# EAGLE design Cubesat (EAGLE 7.7.0)
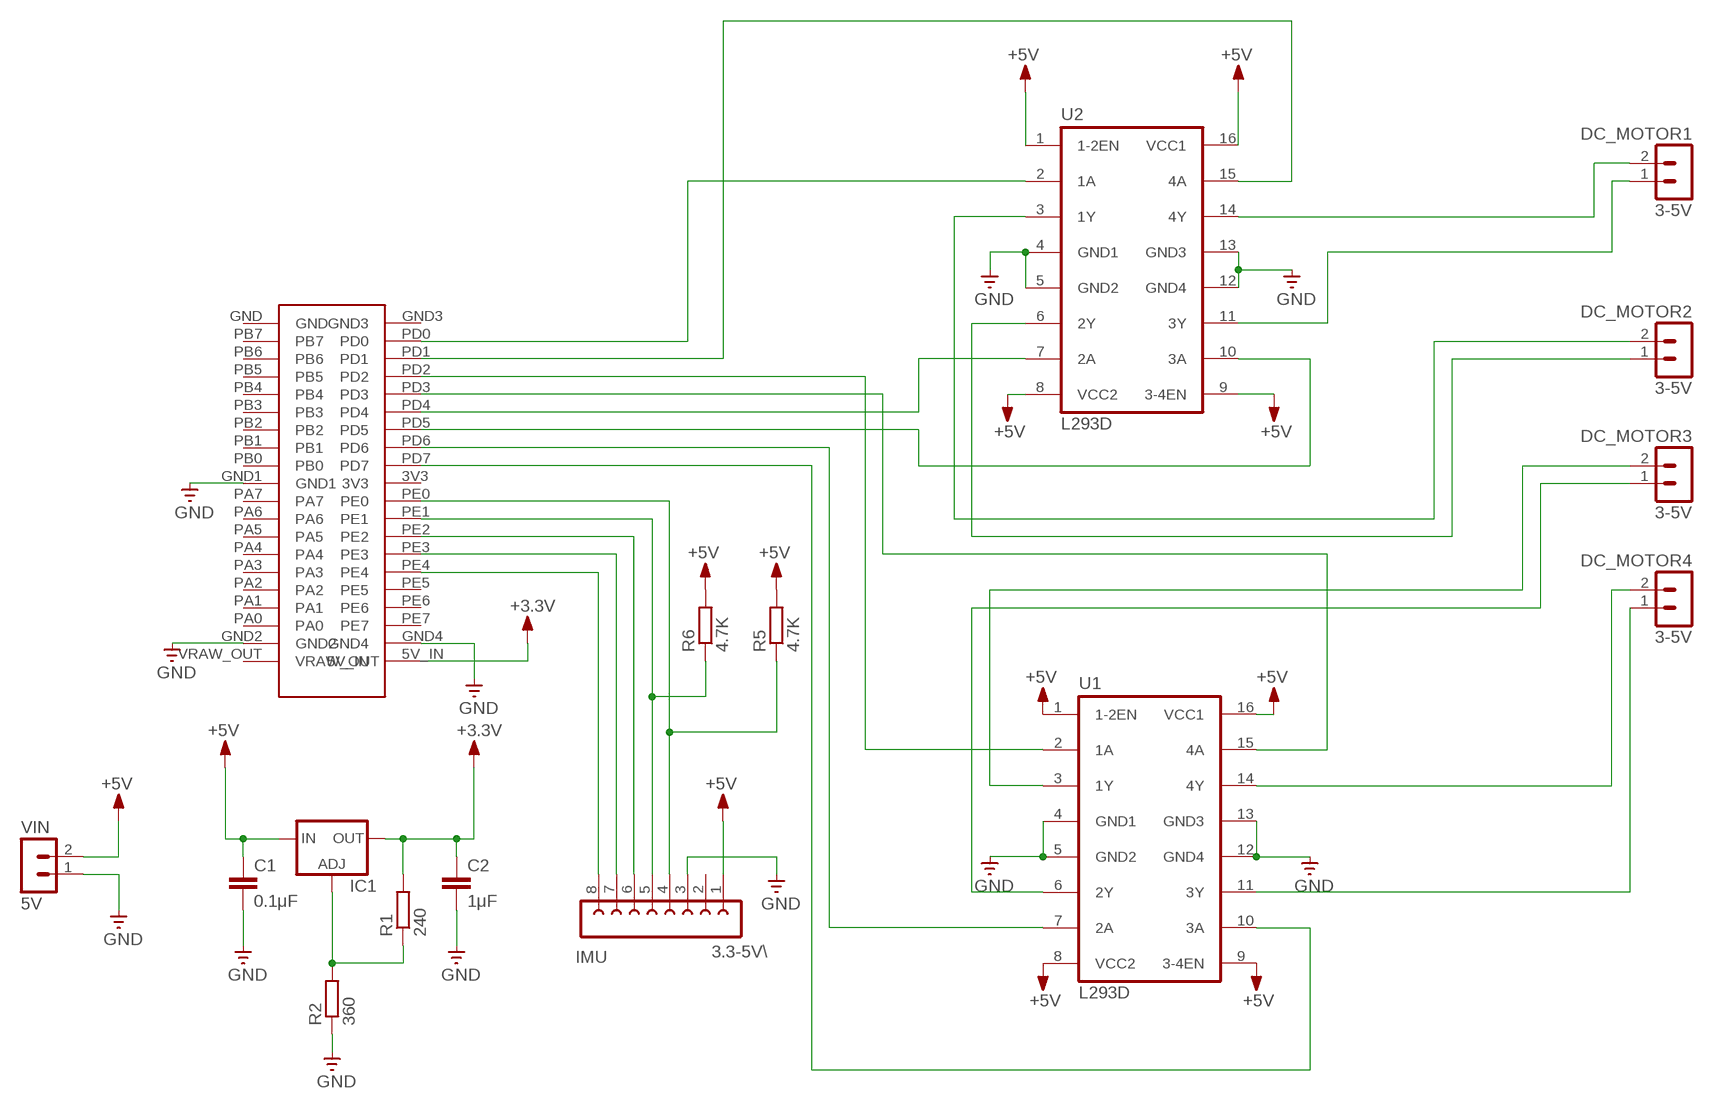
[diagram p0: schematic, sheet 1]

## Parts
C1  0.1μF  C-EUC1210  [C1210]
C2  1μF  C-EUC1210  [C1210]
DC_MOTOR1  3-5V  MA02-1Y  [MA02-1Y]
DC_MOTOR2  3-5V  MA02-1Y  [MA02-1Y]
DC_MOTOR3  3-5V  MA02-1Y  [MA02-1Y]
DC_MOTOR4  3-5V  MA02-1Y  [MA02-1Y]
IC1  LM317TS  [317TS]
IMU  3.3-5V\  FE08-1  [FE08-1]
R1  240  R-EU_M2012  [M2012]
R2  360  R-EU_M2012  [M2012]
R5  4.7K  R-EU_M2012  [M2012]
R6  4.7K  R-EU_M2012  [M2012]
U1  L293D  [DIL16]
U2  L293D  [DIL16]
VIN  5V  MA02-1Y  [MA02-1Y]
XMEGA256A3U  ATXMEGA256A3U  [ATXMEGA256A3U]

## Nets
+5V: C1.1 C2.1 IC1.2(OUT) IC1.3(IN) IMU.1 R1.2 R5.2 R6.2 U1.1(1-2EN) U1.8(VCC2) U1.9(3-4EN) U1.16(VCC1) U2.1(1-2EN) U2.8(VCC2) U2.9(3-4EN) U2.16(VCC1) VIN.2 XMEGA256A3U.5V_IN ; supply symbol labelled +3.3V
GND: C1.2 C2.2 IMU.3 R2.1 U1.4(GND1) U1.5(GND2) U1.12(GND4) U1.13(GND3) U2.4(GND1) U2.5(GND2) U2.12(GND4) U2.13(GND3) VIN.1 XMEGA256A3U.GND1 XMEGA256A3U.GND2 XMEGA256A3U.GND4
N$1: DC_MOTOR1.2 U2.14(4Y)
N$2: DC_MOTOR1.1 U2.11(3Y)
N$3: U2.2(1A) XMEGA256A3U.PD0
N$4: U1.2(1A) XMEGA256A3U.PD2
N$5: IMU.4 R5.1 XMEGA256A3U.PE0
N$6: IMU.5 R6.1 XMEGA256A3U.PE1
N$7: DC_MOTOR2.2 U2.3(1Y)
N$8: DC_MOTOR2.1 U2.6(2Y)
N$9: IMU.6 XMEGA256A3U.PE2
N$10: DC_MOTOR3.1 U1.6(2Y)
N$11: U1.15(4A) XMEGA256A3U.PD3
N$12: U2.7(2A) XMEGA256A3U.PD4
N$13: IMU.7 XMEGA256A3U.PE3
N$14: DC_MOTOR4.2 U1.14(4Y)
N$15: DC_MOTOR3.2 U1.3(1Y)
N$16: DC_MOTOR4.1 U1.11(3Y)
N$17: U1.10(3A) XMEGA256A3U.PD7
N$18: IMU.8 XMEGA256A3U.PE4
N$19: U2.15(4A) XMEGA256A3U.PD1
N$20: U1.7(2A) XMEGA256A3U.PD6
N$21: U2.10(3A) XMEGA256A3U.PD5
N$23: IC1.1(ADJ) R1.1 R2.2
Unconnected: IMU.2 XMEGA256A3U.3V3 XMEGA256A3U.GND XMEGA256A3U.GND3 XMEGA256A3U.PA0 XMEGA256A3U.PA1 XMEGA256A3U.PA2 XMEGA256A3U.PA3 XMEGA256A3U.PA4 XMEGA256A3U.PA5 XMEGA256A3U.PA6 XMEGA256A3U.PA7 XMEGA256A3U.PB0 XMEGA256A3U.PB1 XMEGA256A3U.PB2 XMEGA256A3U.PB3 XMEGA256A3U.PB4 XMEGA256A3U.PB5 XMEGA256A3U.PB6 XMEGA256A3U.PB7 XMEGA256A3U.PE5 XMEGA256A3U.PE6 XMEGA256A3U.PE7 XMEGA256A3U.VRAW_OUT

## Library data of the parts
C1 C2 = rcl:C-EU: CAPACITOR, European symbol
DC_MOTOR1-DC_MOTOR4 VIN = con-lstb:MA02-1: PIN HEADER
IC1 = v-reg:LM317TS: VOLTAGE REGULATOR
IMU = con-lsta:FE08-1: FEMALE HEADER
R1 R2 R5 R6 = rcl:R-EU_: RESISTOR, European symbol
U1 U2 = st-microelectronics:L293D: PUSH-PULL 4 CHANNEL DRIVER
XMEGA256A3U = atxmega256a3u:ATXMEGA256A3U

## Board
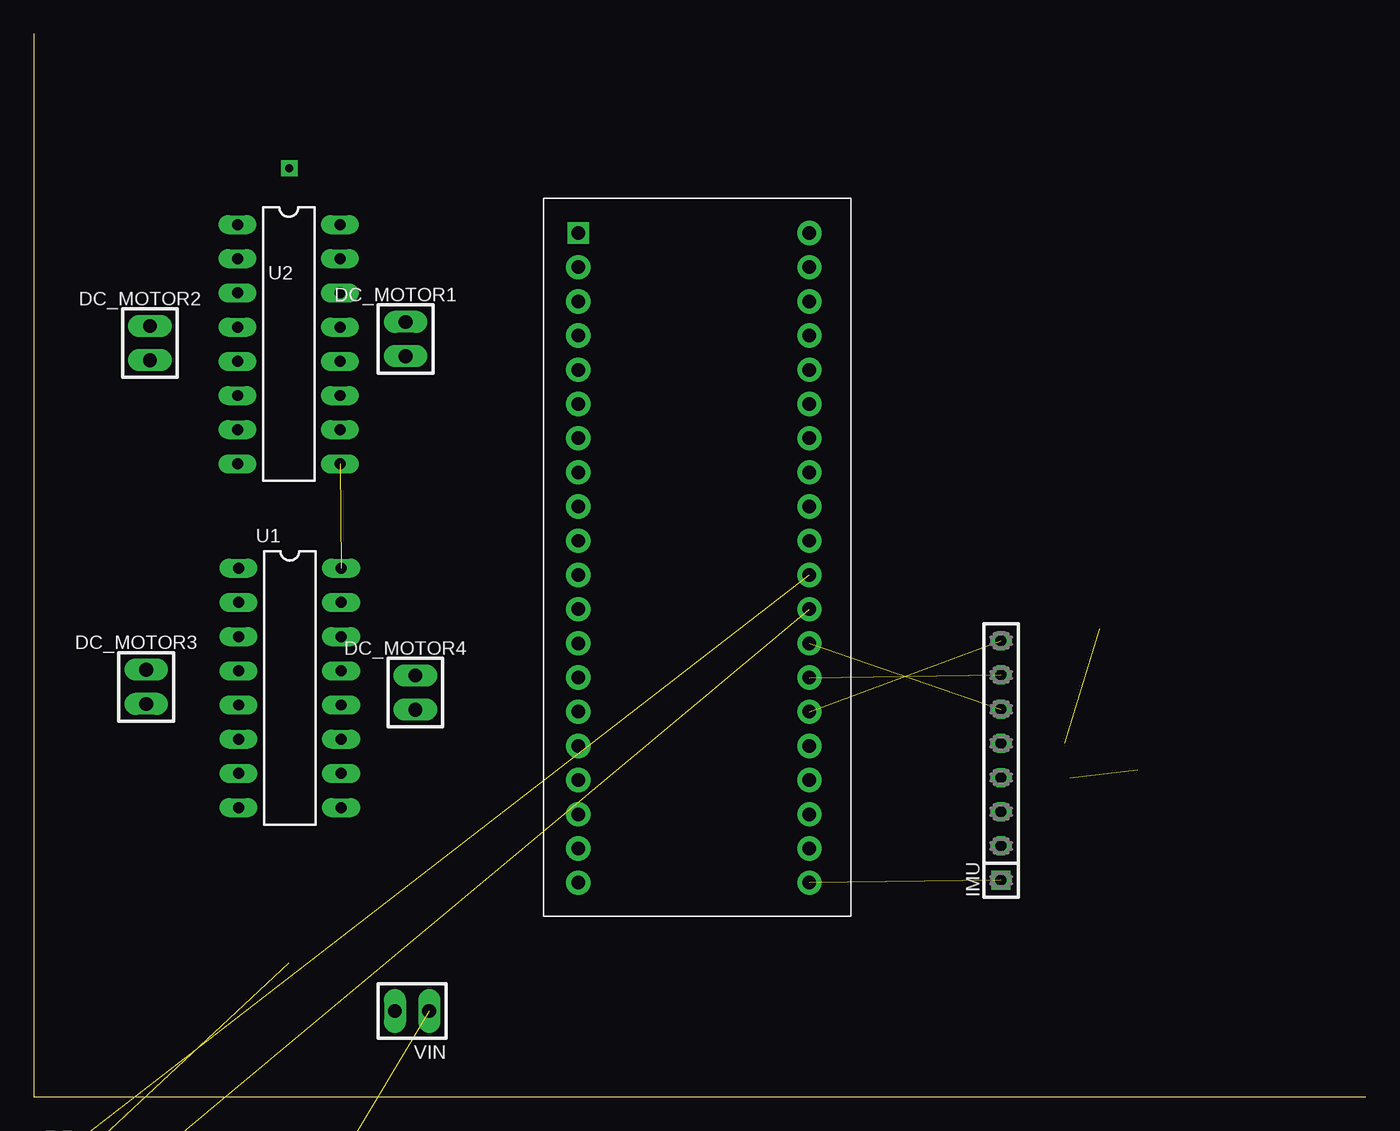
[diagram p1: board, top side]
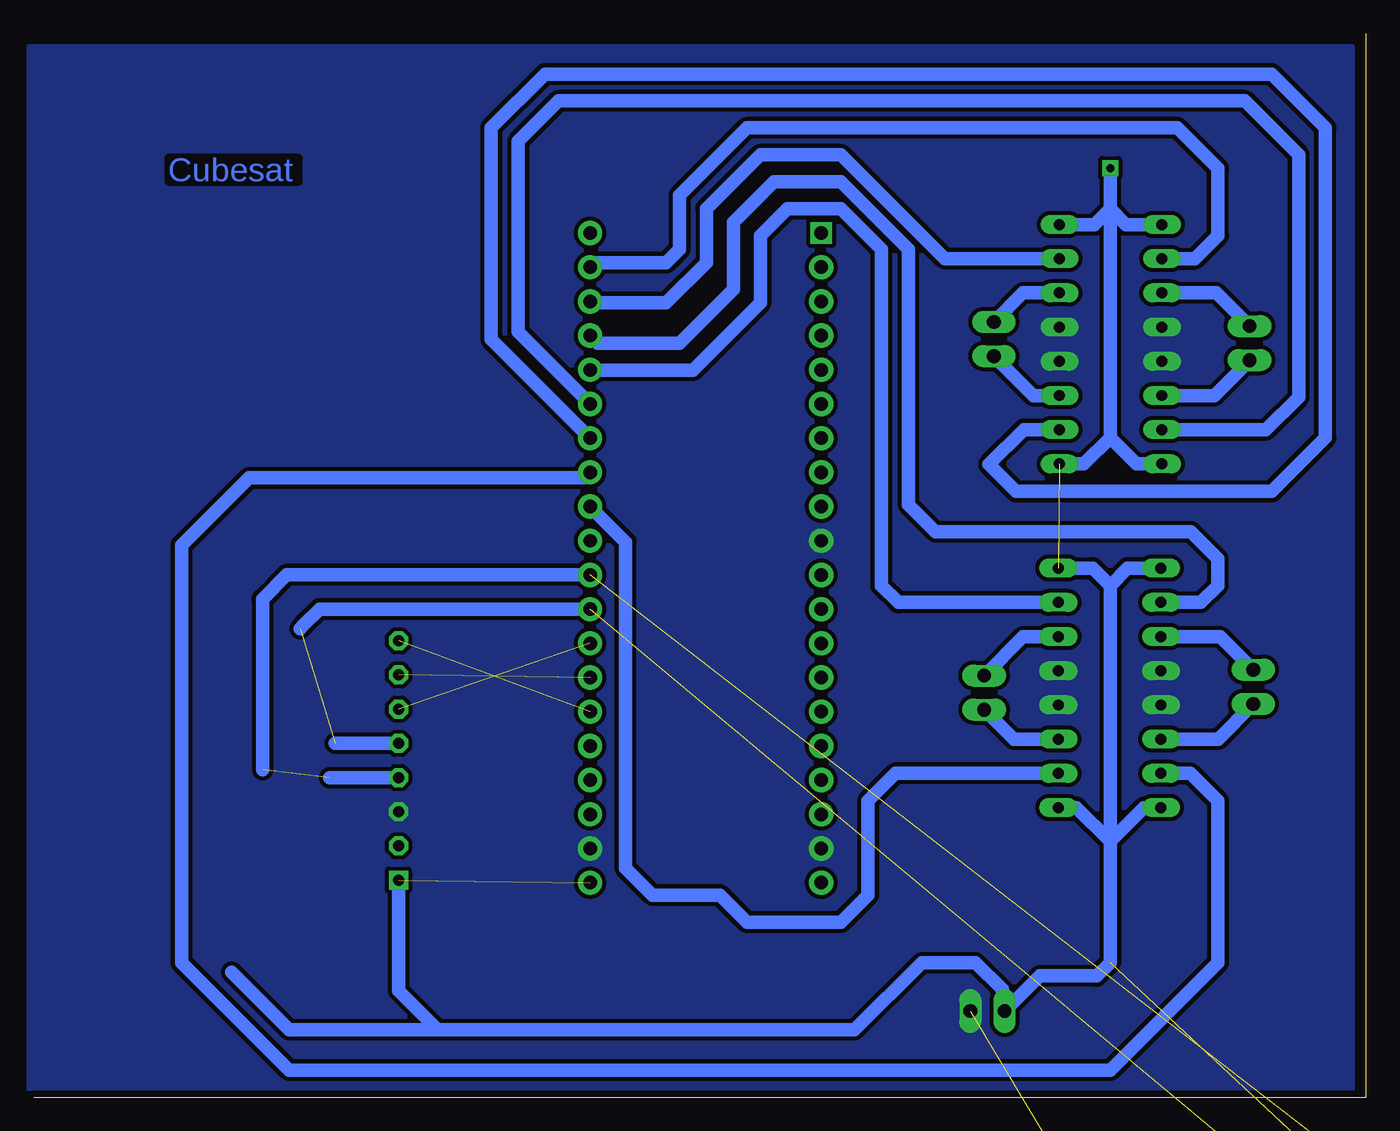
[diagram p2: board, bottom side, seen from below]

Size 99 x 79 mm. Coordinates in mm from the lower left corner, seen from the top.
Outline: 99,0 0,0 0,79
Copper layers (1*16): Top 0.035mm / dielectric 1.5mm / Bottom 0.035mm
Design rules "HVA-LPKF": minimum track width 0.3mm, minimum drill 0.6mm, track to track 0.3mm, track to pad 0.3mm, pad to pad 0.3mm, via to via 0.3mm, smd to smd 0.3mm, copper to edge 0.5mm, drill to drill 0.5mm, minimum pad ring 0.3mm, minimum via ring 0.3mm, stop-mask expansion 0.1mm, vias tented up to drill 0mil, thermal gap 0.3mm

### Footprints (pad centres in the part's own frame; a part is rotated, then mirrored left to right if it is on the bottom)
C1210 = smd 1.6 x 2.7: 1 -1.4,0; 2 1.4,0
MA02-1Y = drill 1.016 long: 1 -1.27,0; 2 1.27,0
317TS = drill 1.016 long: 1 -2.54,-2.54; 2 0,-2.54; 3 2.54,-2.54
FE08-1 = drill 0.813 square: 1 -8.89,0 | drill 0.813 octagon: 2 -6.35,0; 3 -3.81,0; 4 -1.27,0; 5 1.27,0; 6 3.81,0; 7 6.35,0; 8 8.89,0
M2012 = smd 1.3 x 1.6: 1 -0.95,0; 2 0.95,0
DIL16 = drill 0.813 long: 1 -8.89,-3.81; 2 -6.35,-3.81; 3 -3.81,-3.81; 4 -1.27,-3.81; 5 1.27,-3.81; 6 3.81,-3.81; 7 6.35,-3.81; 8 8.89,-3.81; 9 8.89,3.81; 10 6.35,3.81; 11 3.81,3.81; 12 1.27,3.81; 13 -1.27,3.81; 14 -3.81,3.81; 15 -6.35,3.81; 16 -8.89,3.81
ATXMEGA256A3U = drill 1 pad 1.8: 3V3 9.6,-2.58; 5V_IN 9.6,-27.98; GND1 -7.58,-2.58; GND2 -7.58,-25.44; GND3 9.6,20.28; GND4 9.6,-25.44; PA0 -7.58,-22.9; PA1 -7.58,-20.36; PA2 -7.58,-17.82; PA3 -7.58,-15.28; PA4 -7.58,-12.74; PA5 -7.58,-10.2; PA6 -7.58,-7.66; PA7 -7.58,-5.12; PB0 -7.58,-0.04; PB1 -7.58,2.5; PB2 -7.58,5.04; PB3 -7.58,7.58; PB4 -7.58,10.12; PB5 -7.58,12.66; PB6 -7.58,15.2; PB7 -7.58,17.74; PD0 9.6,17.74; PD1 9.6,15.2; PD2 9.6,12.66; PD3 9.6,10.12; PD4 9.6,7.58; PD5 9.6,5.04; PD6 9.6,2.5; PD7 9.6,-0.04; PE0 9.6,-5.12; PE1 9.6,-7.66; PE2 9.6,-10.2; PE3 9.6,-12.74; PE4 9.6,-15.28; PE5 9.6,-17.82; PE6 9.6,-20.36; PE7 9.6,-22.9; VRAW_OUT -7.58,-27.98 | drill 1 square: GND -7.58,20.28

### Placement (x,y rotation side)
C1  -6,-39 0 top  (outside the outline)
C2  -14,-39 0 top  (outside the outline)
DC_MOTOR1  27.64,56.31 90 top
DC_MOTOR2  8.64,56.01 90 top
DC_MOTOR3  8.36,30.48 90 top
DC_MOTOR4  28.36,30.05 90 top
IC1  11,-20 0 top  (outside the outline)
IMU  71.89,25.01 90 top
R1  2,-34 0 top  (outside the outline)
R2  2,-41 0 top  (outside the outline)
R5  2,-5 0 top  (outside the outline)
R6  2,-11 0 top  (outside the outline)
U1  19.04,30.4 270 top
U2  18.96,55.93 270 top
VIN  28.12,6.39 180 top
XMEGA256A3U  48.05,43.91 0 top

### Tracks (layer width: path | path; a pad name or v marks a point on that pad's centre or on a via)
+5V  (via drill 0.6)  (9 unrouted)
  Bottom 1: U2.8 17.04,47.04 19,49 | 19,49 19,66 | 19,66 v19,69 | U2.9 20.96,47.04 19,49 | U2.1 17.82,64.82 19,66 | U2.16 20.18,64.82 19,66 | 20,9 24.24,9 VIN.2 27,6.54 27,8 29,10 33,10 38,5 69,5 | 84.29,9.29 80,5 69,5 | IMU.1 71.89,7.89 69,5
  Bottom 1.016: U1.1 17.71,39.29 19,38 | 19,38 19,19 | U1.16 20.29,39.29 19,38 | U1.8 16.49,21.51 19,19 | U1.9 21.51,21.51 19,19 | 19,19 19,10 20,9
GND  (3 unrouted)
  pour Bottom (no thermals): 1,78.01 99.33,78.01 99.33,0 1,0
N$1
  Bottom 1: U2.14 25.48,59.74 DC_MOTOR1.2
N$2
  Bottom 1: U2.11 24.72,52.12 DC_MOTOR1.1
N$3
  Bottom 1.016: U2.2 12.72,62.28 11,64 11,69 14,72 46,72 51,67 51,63 52,62 57.3,62 XMEGA256A3U.PD0
N$4
  Bottom 1: U1.2 12.25,36.75 11,38 11,40 13,42 32,42 34,44 34,63
  Bottom 1.016: 34,63 39,68 44,68 47,65 47,60 51,56 57.08,56 XMEGA256A3U.PD2
N$5  (2 unrouted)
  Bottom 1: IMU.4 77.01,23.74 | 82,37 82,24.33
  Bottom 1.016: XMEGA256A3U.PE0 80.21,38.79 82,37
N$6  (2 unrouted)
  Bottom 1: IMU.5 76.6,26.28 | 79.21,34.79 79,35
  Bottom 1.016: XMEGA256A3U.PE1 77.75,36.25 79,35
N$7
  Bottom 1: U2.3 11.1,59.74 DC_MOTOR2.2
N$8
  Bottom 1: U2.6 11.26,52.12 DC_MOTOR2.1
N$9  (1 unrouted)
N$10
  Bottom 1: U1.6 10.98,26.59 DC_MOTOR3.1
N$11
  Bottom 1.016: U1.15 34.75,36.75 36,38 36,63 39,66 43,66 45,64 45,59 50,54 57.62,54 XMEGA256A3U.PD3
N$12
  Bottom 1.016: U2.7 7.42,49.58 5,52 5,70 9,74 60,74 63,71 63,56.84 XMEGA256A3U.PD4
N$13  (1 unrouted)
N$14
  Bottom 1: U1.14 25.47,34.21 DC_MOTOR4.2
N$15
  Bottom 1: U1.3 10.82,34.21 DC_MOTOR3.2
N$16
  Bottom 1: U1.11 26.17,26.59 DC_MOTOR4.1
N$17
  Bottom 1.016: U1.10 34.95,24.05 37,22 37,15 39,13 46,13 48,15 53,15 55,17 55,41.22 XMEGA256A3U.PD7
N$18  (1 unrouted)
N$19
  Bottom 1.016: U2.15 31.28,62.28 39,70 45,70 49,66 49,62 52,59 57.54,59 XMEGA256A3U.PD1
N$20
  Bottom 1.016: U1.7 13.05,24.05 11,22 11,10 19,2 80,2 88,10 88,41 83,46 58.06,46 XMEGA256A3U.PD6
N$21
  Bottom 1.016: U2.10 25.42,49.58 28,47 26,45 7,45 3,49 3,72 7,76 61,76 65,72 65,56.3 XMEGA256A3U.PD5
N$23  (2 unrouted)

### Text on the board
Bottom: Cubesat